# EAGLE design penghis_cahn (EAGLE 7.6.0)
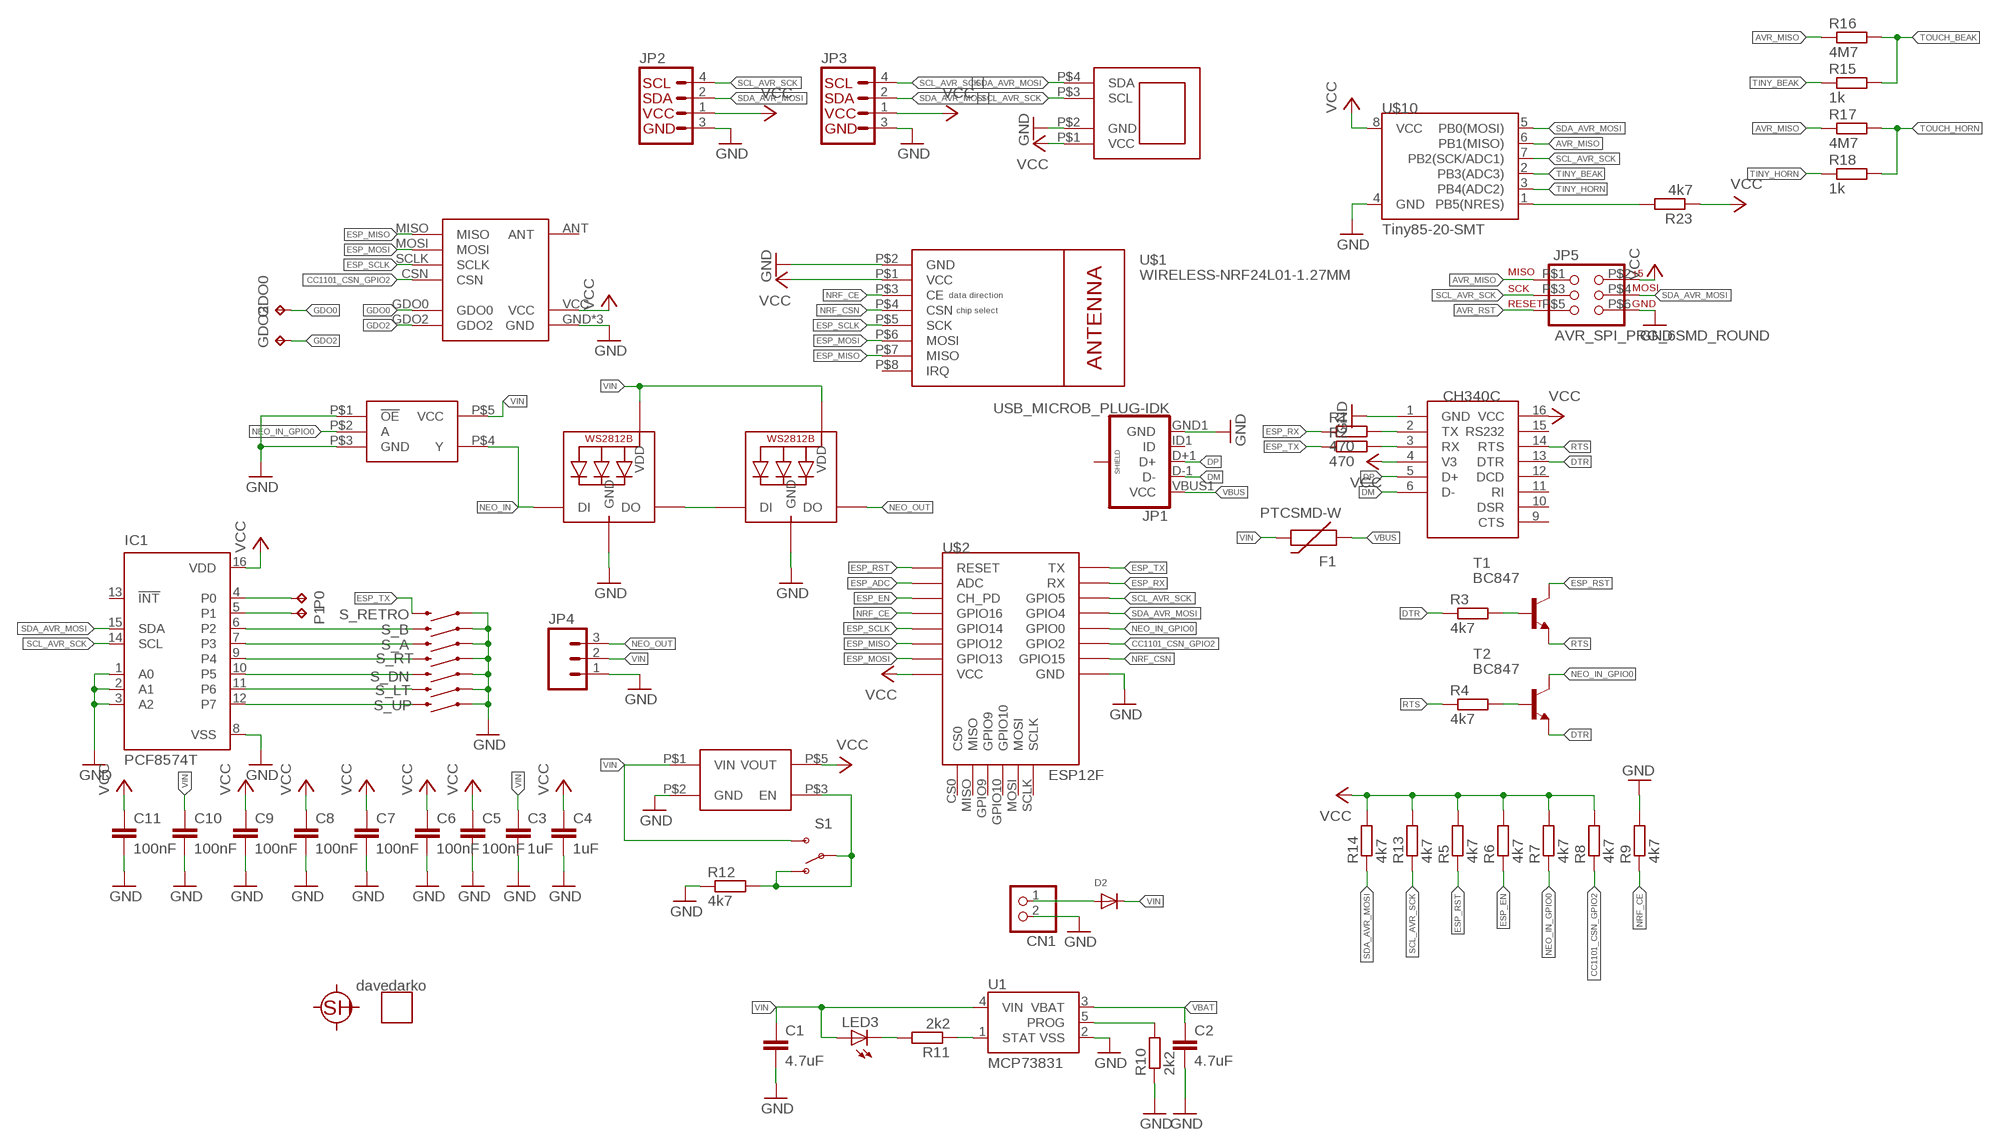
[diagram p0: schematic, sheet 1]

## Parts
C1  4.7uF  C-EUC0805  [C0805]
C2  4.7uF  C-EUC0805  [C0805]
C3  1uF  C-EUC0805  [C0805]
C4  1uF  C-EUC0805  [C0805]
C5  100nF  C-EUC0805  [C0805]
C6  100nF  C-EUC0805  [C0805]
C7  100nF  C-EUC0805  [C0805]
C8  100nF  C-EUC0805  [C0805]
C9  100nF  C-EUC0805  [C0805]
C10  100nF  C-EUC0805  [C0805]
C11  100nF  C-EUC0805  [C0805]
CN1  JST_2PIN-SMT-RA  [JST-PH-2-SMT-RA]
D2  DIODESOD-123  [SOD-123]
F1  PTCSMD-W  [PTC-1206-WIDE]
GDO0  TPB1,27  [B1,27]
GDO2  TPB1,27  [B1,27]
IC1  PCF8574T  [SO16W]
JP1  USB_MICROB_PLUG-IDK  [USB-AB-MICRO-SMD_SLOT]
JP2  I2C_STANDARDI2C_SAO  [2X2]
JP3  I2C_STANDARDI2C_SAO  [2X2]
JP4  M03LOCK  [1X03_LOCK]
JP5  AVR_SPI_PRG_6SMD_ROUND  [2X3_SMD_PAD_ROUND]
LED1  WS2812B5050  [WS2812B]
LED2  WS2812B5050  [WS2812B]
LED3  LEDCHIP-LED0603  [CHIP-LED0603]
P0  TPB1,27  [B1,27]
P1  TPB1,27  [B1,27]
R1  470  R-EU_R0603  [R0603]
R2  470  R-EU_R0603  [R0603]
R3  4k7  R-EU_R0603  [R0603]
R4  4k7  R-EU_R0603  [R0603]
R5  4k7  R-EU_R0603  [R0603]
R6  4k7  R-EU_R0603  [R0603]
R7  4k7  R-EU_R0603  [R0603]
R8  4k7  R-EU_R0603  [R0603]
R9  4k7  R-EU_R0603  [R0603]
R10  2k2  R-EU_R0603  [R0603]
R11  2k2  R-EU_R0603  [R0603]
R12  4k7  R-EU_R0603  [R0603]
R13  4k7  R-EU_R0603  [R0603]
R14  4k7  R-EU_R0603  [R0603]
R15  1k  R-EU_R0603  [R0603]
R16  4M7  R-EU_R0603  [R0603]
R17  4M7  R-EU_R0603  [R0603]
R18  1k  R-EU_R0603  [R0603]
R23  4k7  R-EU_R0603  [R0603]
S1  SWITCH-SPDT-SMD-A  [SWITCH-SPST-SMD-A]
S_A  SWITCH-MOMENTARY-2-SMD-1101NE  [TACTILE-SWITCH-1101NE]
S_B  SWITCH-MOMENTARY-2-SMD-1101NE  [TACTILE-SWITCH-1101NE]
S_DN  SWITCH-MOMENTARY-2-SMD-1101NE  [TACTILE-SWITCH-1101NE]
S_LT  SWITCH-MOMENTARY-2-SMD-1101NE  [TACTILE-SWITCH-1101NE]
S_RETRO  SWITCH-MOMENTARY-2-SMD-1101NE  [TACTILE-SWITCH-1101NE]
S_RT  SWITCH-MOMENTARY-2-SMD-1101NE  [TACTILE-SWITCH-1101NE]
S_UP  SWITCH-MOMENTARY-2-SMD-1101NE  [TACTILE-SWITCH-1101NE]
T1  BC847  [SOT23]
T2  BC847  [SOT23]
U1  MCP73831  [SOT23-5]
U$1  WIRELESS-NRF24L01-1.27MM  [WIRELESS-NRF24L01-1.27MM]
U$2  ESP12F  [ESP12PAD]
U$3  AP2112KAP2112K  [AP2112]
U$4  CH340CCH340C  [SOIC16]
U$5  SN74LV1T125  [SN74LV1T125DBVR]
U$6  CC1101  [CC1101]
U$7  OLED_I2C_VGCD  [OLED_1.3]
U$8  OSHPARK_100MIL_TXT  [OSHPARK_LOGO]
U$9  DAVEDARKODDGOLD  [DAVEDARKO_GOLD]
U$10  Tiny85-20-SMT  ATTINY45TINY85-20-SMT  [SO08-EIAJ]

## Nets
AVR_MISO: JP5.P$1 R16.1 R17.1 U$10.6(PB1(MISO))
AVR_RST: JP5.P$5 R23.2 U$10.1(PB5(NRES))
CC1101_CSN_GPIO2: R8.1 U$2.GPIO2 U$6.CSN
DM: JP1.D-1(D-) U$4.6(D-)
DP: JP1.D+1(D+) U$4.5(D+)
DTR: R3.1 T2.2(E) U$4.13(DTR)
ESP_ADC: U$2.ADC
ESP_EN: R6.1 U$2.EN(CH_PD)
ESP_MISO: U$1.P$7(MISO) U$2.GPIO12 U$6.MISO
ESP_MOSI: U$1.P$6(MOSI) U$2.GPIO13 U$6.MOSI
ESP_RST: R5.1 T1.3(C) U$2.RST(RESET)
ESP_RX: R1.1 U$2.RX
ESP_SCLK: U$1.P$5(SCK) U$2.GPIO14 U$6.SCLK
ESP_TX: R2.1 S_RETRO.P$2 U$2.TX
GDO0: GDO0.TP U$6.GDO0
GDO2: GDO2.TP U$6.GDO2
GND: C1.2 C2.2 C3.2 C4.2 C5.2 C6.2 C7.2 C8.2 C9.2 C10.2 C11.2 CN1.2 IC1.1(A0) IC1.2(A1) IC1.3(A2) IC1.8(VSS) JP1.GND1(GND) JP2.3(GND) JP3.3(GND) JP4.1 JP5.P$6 LED1.3-GND(GND) LED2.3-GND(GND) R9.2 R10.1 R12.1 S_A.P$1 S_B.P$1 S_DN.P$1 S_LT.P$1 S_RETRO.P$1 S_RT.P$1 S_UP.P$1 U1.2(VSS) U$1.P$2(GND) U$2.GND U$3.P$2(GND) U$4.1(GND) U$5.P$1(!OE) U$5.P$3(GND) U$6.GND U$6.GND2(GND) U$6.GND3(GND) U$7.P$2(GND) U$10.4(GND)
N$1: LED1.2-DOUT(DO) LED2.4-DIN(DI)
N$2: IC1.12(P7) S_UP.P$2
N$3: IC1.11(P6) S_LT.P$2
N$4: IC1.10(P5) S_DN.P$2
N$5: IC1.9(P4) S_RT.P$2
N$6: R3.2 T1.1(B)
N$7: R4.2 T2.1(B)
N$8: IC1.7(P3) S_A.P$2
N$9: R12.2 S1.1(O) S1.2(P) U$3.P$3(EN)
N$10: R10.2 U1.5(PROG)
N$11: R11.1 U1.1(STAT)
N$12: R2.2 U$4.3(RX)
N$13: R1.2 U$4.2(TX)
N$14: IC1.6(P2) S_B.P$2
N$15: LED3.C R11.2
NEO_IN: LED1.4-DIN(DI) U$5.P$4(Y)
NEO_IN_GPIO0: R7.1 T2.3(C) U$2.GPIO0 U$5.P$2(A)
NEO_OUT: JP4.3 LED2.2-DOUT(DO)
NRF_CE: R9.1 U$1.P$3(CE) U$2.GPIO16
NRF_CSN: U$1.P$4(CSN) U$2.GPIO15
P0: IC1.4(P0) P0.TP
P1: IC1.5(P1) P1.TP
RTS: R4.1 T1.2(E) U$4.14(RTS)
SCL_AVR_SCK: IC1.14(SCL) JP2.4(SCL) JP3.4(SCL) JP5.P$3 R13.1 U$2.GPIO5 U$7.P$3(SCL) U$10.7(PB2(SCK/ADC1))
SDA_AVR_MOSI: IC1.15(SDA) JP2.2(SDA) JP3.2(SDA) JP5.P$4 R14.1 U$2.GPIO4 U$7.P$4(SDA) U$10.5(PB0(MOSI))
TINY_BEAK: R15.1 U$10.2(PB3(ADC3))
TINY_HORN: R18.1 U$10.3(PB4(ADC2))
TOUCH_BEAK: R15.2 R16.2
TOUCH_HORN: R17.2 R18.2
VBAT: C2.1 CN1.1 D2.A U1.3(VBAT)
VBUS: F1.1 JP1.VBUS1(VCC)
VCC: C4.1 C5.1 C6.1 C7.1 C8.1 C9.1 C11.1 IC1.16(VDD) JP2.1(VCC) JP3.1(VCC) JP5.P$2 R5.2 R6.2 R7.2 R8.2 R13.2 R14.2 R23.1 U$1.P$1(VCC) U$2.VCC U$3.P$5(VOUT) U$4.4(V3) U$4.16(VCC) U$6.VCC U$7.P$1(VCC) U$10.8(VCC)
VIN: C1.1 C3.1 C10.1 D2.C F1.2 JP4.2 LED1.1-VDD(VDD) LED2.1-VDD(VDD) LED3.A S1.3(S) U1.4(VIN) U$3.P$1(VIN) U$5.P$5(VCC)
Unconnected: IC1.13(!INT) JP1.ID1(ID) JP1.P$1(SHIELD) JP1.P$2(SHIELD) JP1.P$3(SHIELD) JP1.P$4(SHIELD) U$1.P$8(IRQ) U$2.CS0 U$2.GPIO9 U$2.GPIO10 U$2.MISO U$2.MOSI U$2.SCLK U$4.9(CTS) U$4.10(DSR) U$4.11(RI) U$4.12(DCD) U$4.15(RS232) U$6.ANT

## Notes on the sheet
- data direction
- chip select

## Library data of the parts
C1-C11 = rcl:C-EU: CAPACITOR, European symbol
CN1 = adafruit:JST_2PIN: JST 2-Pin Connectors of various flavors SMT-RA (S2B-PH-SM4) 4UConnector #17311 SMT (B2B-PH-SM4) THM-RA (S2B-PH) THM (B2B-PH)
D2 = adafruit:DIODE: Diode SMADIODE - SMA Surface Mount Package 20V 1A Schottky Diode Digikey: 641-1014-6-ND DO-1N4148 - Through Hole Small Current Diode SOD-123 20V 1 A (.5mV Vf) Schottky Diode - Digikey: MBRX120TPMSCT-ND SOD-323 10V 570mA (.38mV Vf, 3ns) Schottky Diode - Digikey: ZLLS410CT-ND SOD-523 30V 30mA Schottky Diode (RB751S-40TE61) - Digikey: RB751S-40TE61CT-ND SOT23-R/W - SOT23 Package (R = Solder Paste/Reflow Ovens, W = Hand-Soldering) BAT54Film 40V 300mA - Digikey: 497-7162-1-ND
F1 = SparkFun-PowerIC:PTC: Resettable Fuse PTC Resettable Fuse. Spark Fun Electronics SKU : COM-08357
GDO0 GDO2 P0 P1 = testpad:TP: Test pad
IC1 = micro-philips:PCF8574: I2C-Bus Remote 8-bit I/O expander http://www.semiconductors.philips.com/acrobat_download/datasheets/PCF8574_4.pdf; MPN: PCF8574T/3,512; OC_FARNELL: 1201255; OC_NEWARK: 70R6870
JP1 = SparkFun-Connectors:USB_MICROB_PLUG: USB Micro-B connectors Some male, some female. Watch your step!
JP2 JP3 = SparkFun-Connectors:I2C_STANDARD: SparkFun has standardized on a pinout for all I2C based sensor breakouts. This pinout allows I2C boards to be plugged directly into the headers on Arduino Uno compatible boards, and to be daisy chained easily.
JP4 = SparkFun-Connectors:M03: Header 3 Standard 3-pin 0.1" header. Use with straight break away headers (SKU : PRT-00116), right angle break away headers (PRT-00553), swiss pins (PRT-00743), machine pins (PRT-00117), and female headers (PRT-00115). Molex polarized connector foot print use with SKU : PRT-08232 with associated crimp pins and housings.
JP5 = SparkFun-Connectors:AVR_SPI_PRG_6: AVR ISP 6 Pin This is the reduced ISP connector for AVR programming. Common on Arduino. This footprint will take up less PCB space and can be used with a 10-pin to 6-pin adapter such as SKU: BOB-08508 **Special note about "TEST_POINT" package. The stop mask is on the top side, so if you want your programming test points to be on the bottom of your board, make sure to place this package on the bottom side of the board. This also ensure that the orientation to program from the bottom side will be correct.
LED1 LED2 = adafruit:WS2812B
LED3 = led:LED: LED OSRAM: - CHIPLED LG R971, LG N971, LY N971, LG Q971, LY Q971, LO R971, LY R971 LH N974, LH R974 LS Q976, LO Q976, LY Q976 LO Q996 - Hyper CHIPLED LW Q18S LB Q993, LB Q99A, LB R99A - SideLED LS A670, LO A670, LY A670, LG A670, LP A670 LB A673, LV A673, LT A673, LW A673 LH A674 LY A675 LS A676, LA A676, LO A676, LY A676, LW A676 LS A679, LY A679, LG A679 - Hyper Micro SIDELED® LS Y876, LA Y876, LO Y876, LY Y876 LT Y87S - SmartLED LW L88C, LW L88S LB L89C, LB L89S, LG L890 LS L89K, LO L89K, LY L89K LS L896, LA L896, LO L896, LY L896 - TOPLED LS T670, LO T670, LY T670, LG T670, LP T670 LSG T670, LSP T670, LSY T670, LOP T670, LYG T670 LG T671, LOG T671, LSG T671 LB T673, LV T673, LT T673, LW T673 LH T674 LS T676, LA T676, LO T676, LY T676, LB T676, LH T676, LSB T676, LW T676 LB T67C, LV T67C, LT T67C, LS T67K, LO T67K, LY T67K, LW E67C LS E67B, LA E67B, LO E67B, LY E67B, LB E67C, LV E67C, LT E67C LW T67C LS T679, LY T679, LG T679 LS T770, LO T770, LY T770, LG T770, LP T770 LB T773, LV T773, LT T773, LW T773 LH T774 LS E675, LA E675, LY E675, LS T675 LS T776, LA T776, LO T776, LY T776, LB T776 LHGB T686 LT T68C, LB T68C - Hyper Mini TOPLED® LB M676 - Mini TOPLED Santana® LG M470 LS M47K, LO M47K, LY M47K Source: http://www.osram.convergy.de LUXEON: - LUMILED® LXK2-PW12-R00, LXK2-PW12-S00, LXK2-PW14-U00, LXK2-PW14-V00 LXK2-PM12-R00, LXK2-PM12-S00, LXK2-PM14-U00 LXK2-PE12-Q00, LXK2-PE12-R00, LXK2-PE12-S00, LXK2-PE14-T00, LXK2-PE14-U00 LXK2-PB12-K00, LXK2-PB12-L00, LXK2-PB12-M00, LXK2-PB14-N00, LXK2-PB14-P00, LXK2-PB14-Q00 LXK2-PR12-L00, LXK2-PR12-M00, LXK2-PR14-Q00, LXK2-PR14-R00 LXK2-PD12-Q00, LXK2-PD12-R00, LXK2-PD12-S00 LXK2-PH12-R00, LXK2-PH12-S00 LXK2-PL12-P00, LXK2-PL12-Q00, LXK2-PL12-R00 Source: www.luxeon.com KINGBRIGHT: KA-3528ASYC Source: www.kingbright.com
R1-R18 R23 = rcl:R-EU_: RESISTOR, European symbol
S1 = SparkFun-Electromechanical:SWITCH-SPDT: SPDT Switch Simple slide switch, Spark Fun Electronics SKU : COM-00102 DPDT SMT slide switch, AYZ0202, SWCH-08179
S_A S_B S_DN S_LT S_RETRO S_RT S_UP = SparkFun-Electromechanical:SWITCH-MOMENTARY-2: Various NO switches- pushbuttons, reed, etc
T1 T2 = transistor:BC847: NPN TRANSISTOR
U1 = SparkFun-PowerIC:MCP73831: Miniature single cell, fully integrated Li-Ion, Li-polymer charge management controller http://ww1.microchip.com/downloads/en/DeviceDoc/21984a.pdf IC-09995; PROD_ID: IC-09995
U$1 = diy-modules:WIRELESS-NRF24L01-1.27MM
U$2 = esp8266modules:ESP12F
U$3 = TPS2113:AP2112K
U$4 = ch340g:CH340C
U$5 = SN74LV1T125:SN74LV1T125
U$6 = CC1101:CC1101
U$7 = oled:OLED_I2C_VGCD
U$8 = LOGOS:OSHPARK_100MIL_TXT
U$9 = LOGOS:DAVEDARKO
U$10 = SparkFun-DigitalIC:ATTINY45: Atmel 8-pin 2/4/8kB flash uC; PROD_ID: IC-09092

## Board
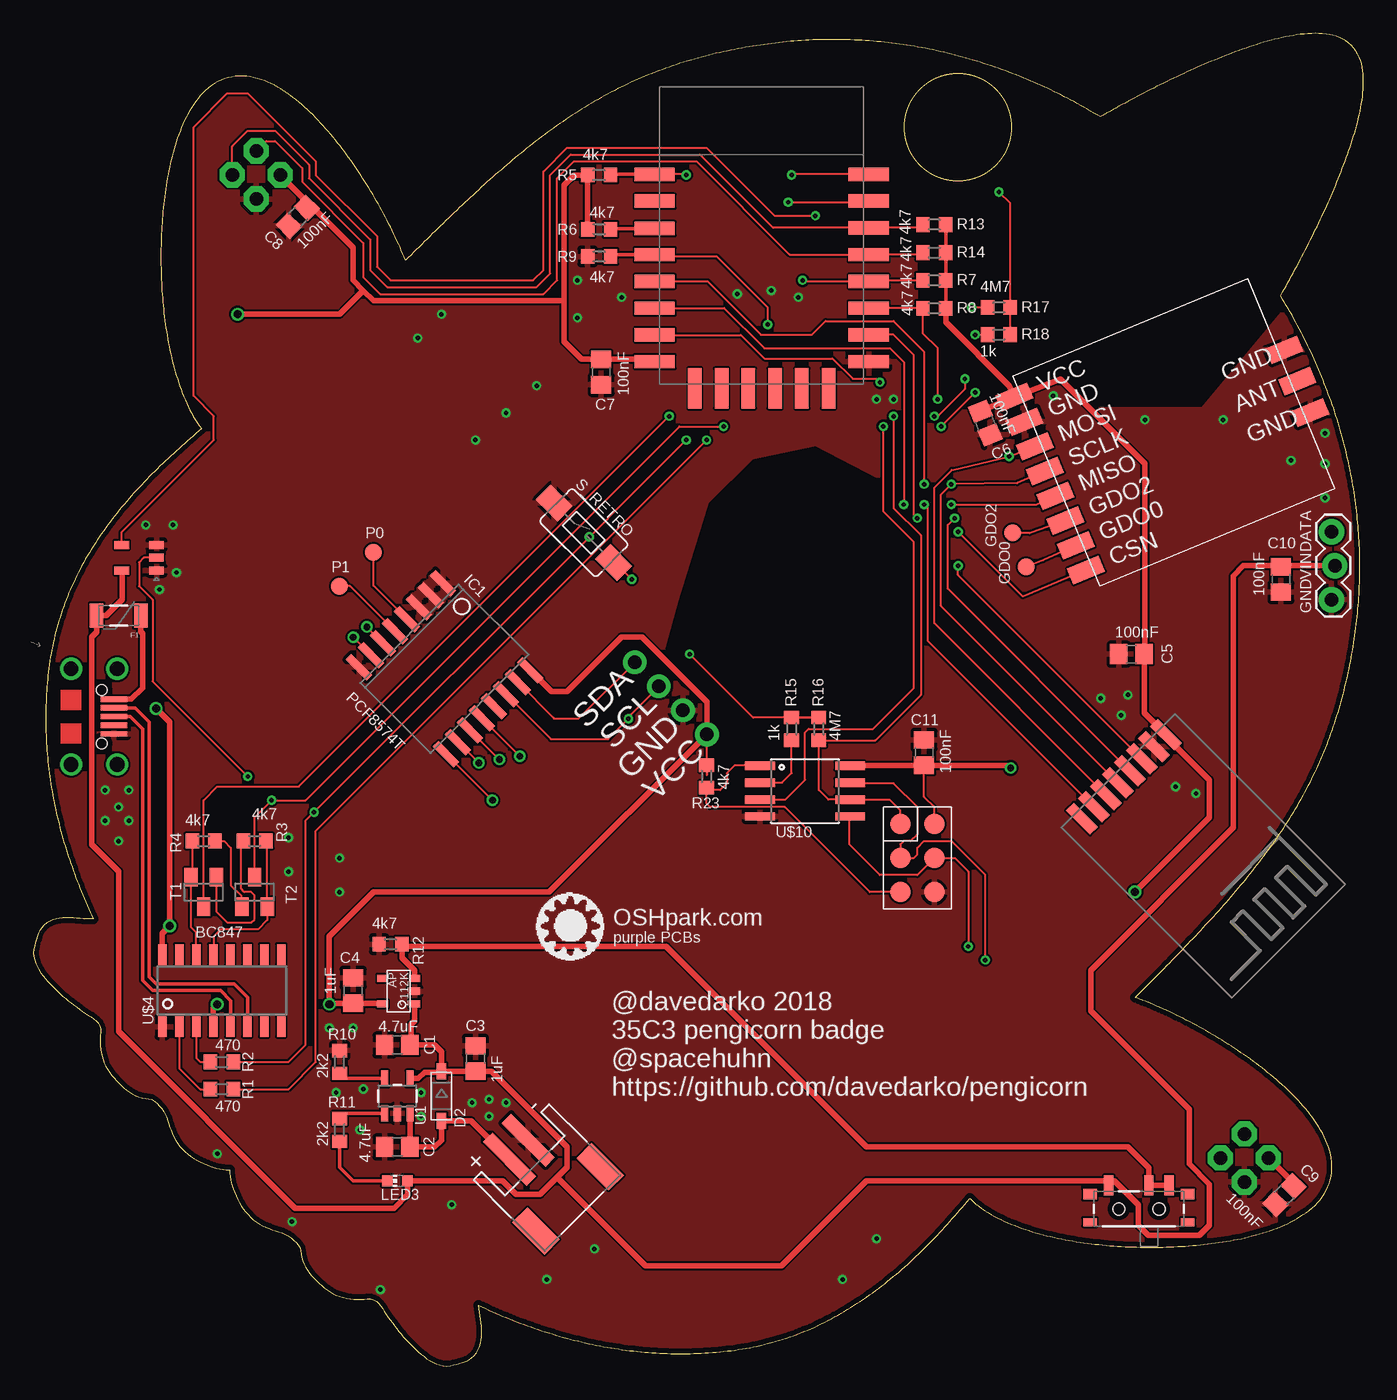
[diagram p1: board, top side]
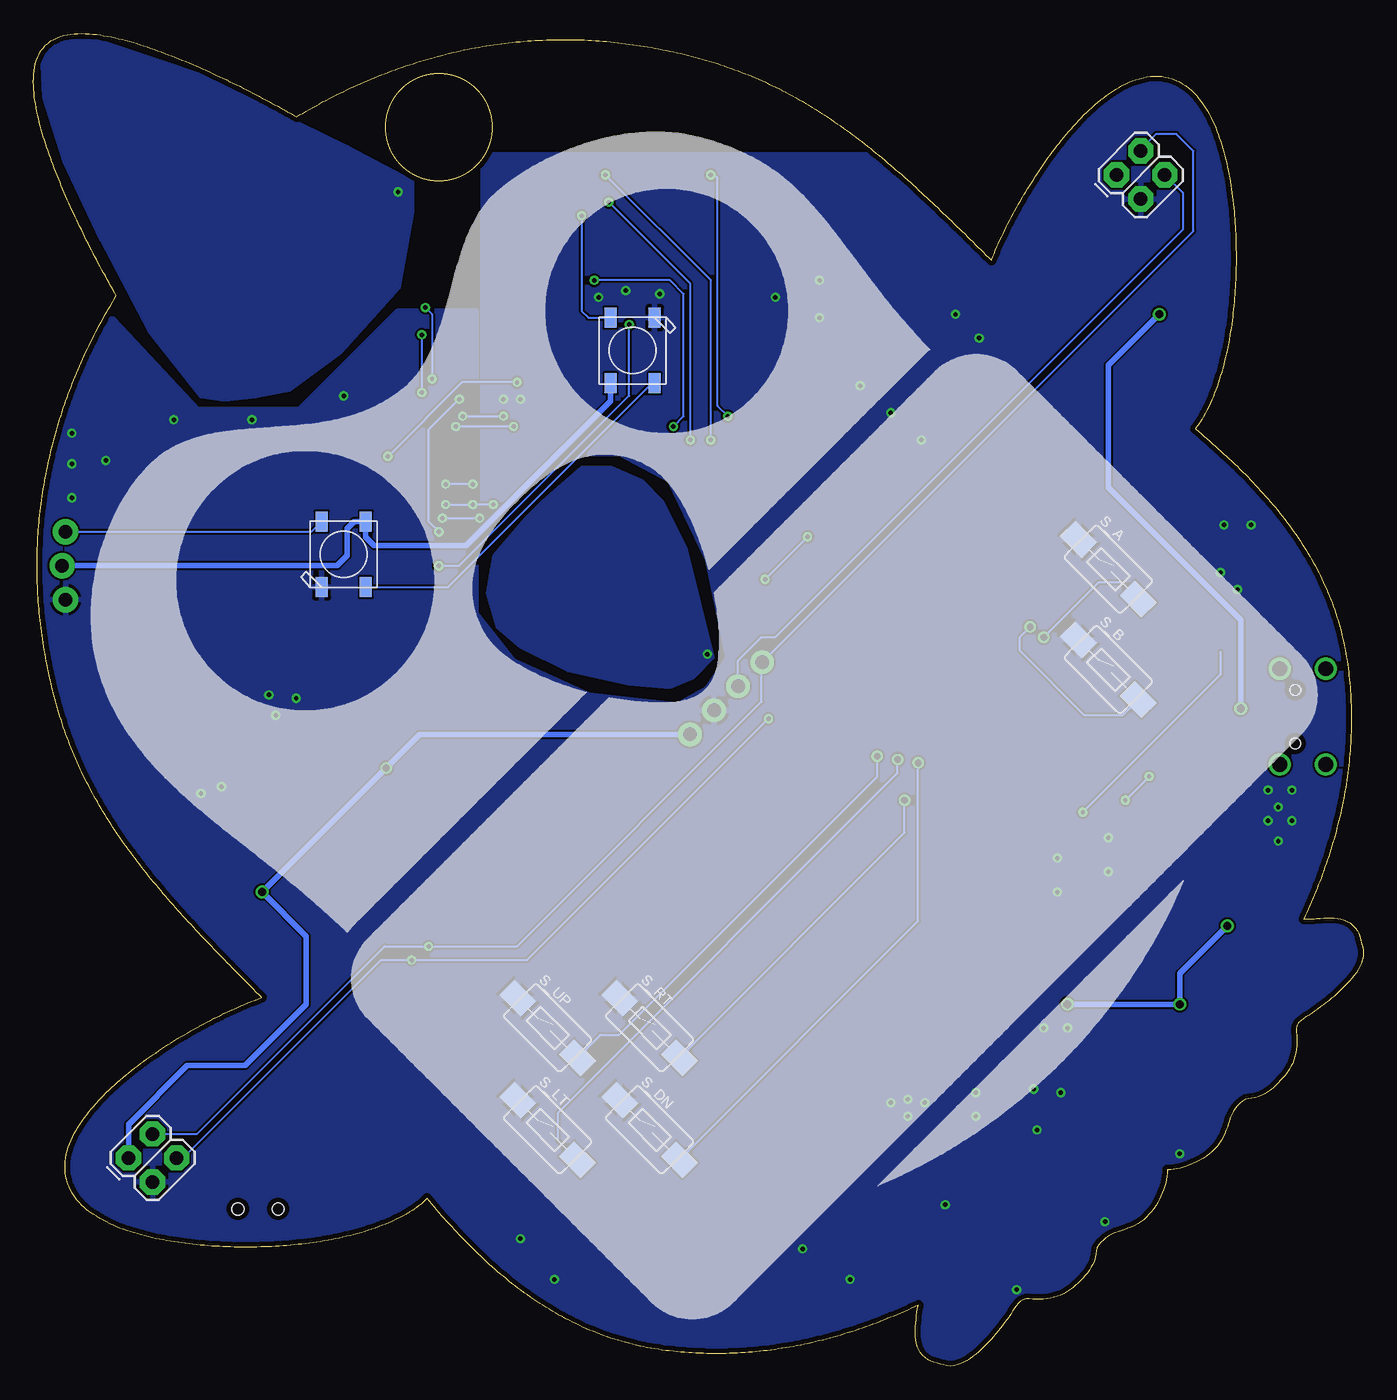
[diagram p2: board, bottom side, seen from below]

Size 99.41 x 99.6 mm. Coordinates in mm from the lower left corner, seen from the top.
Outline: 1439 segments
Outline: circle at 69.11,92.58 radius 4
Copper layers (1*16): Top 0.0356mm / dielectric 1.5011mm / Bottom 0.0356mm
Design rules "LaenPCBOrder *": minimum track width 6mil, minimum drill 13mil, track to track 6mil, track to pad 6mil, pad to pad 6mil, via to via 6mil, smd to smd 6mil, copper to edge 15mil, drill to drill 6mil, minimum pad ring 7mil, minimum via ring 7mil, stop-mask expansion 3mil, vias tented up to drill 200mil, thermal gap 10mil

### Footprints (pad centres in the part's own frame; a part is rotated, then mirrored left to right if it is on the bottom)
C0805 = smd 1.3 x 1.5: 1 -0.95,0; 2 0.95,0
JST-PH-2-SMT-RA = smd 1 x 4.6: 1 1,-3.7; 2 -1,-3.7 | smd 1.6 x 3.4: NC1 -3.4,1.5; NC2 3.4,1.5
SOD-123 = smd 1.2 x 0.7: A 1.85,0; C -1.85,0
PTC-1206-WIDE = smd 1 x 1.8: 1 -1.654,0; 2 1.654,0
B1,27 = smd 1.27 x 1.27: TP 0,0
SO16W = smd 0.6 x 2.2: 1 -4.445,-4.6; 2 -3.175,-4.6; 3 -1.905,-4.6; 4 -0.635,-4.6; 5 0.635,-4.6; 6 1.905,-4.6; 7 3.175,-4.6; 8 4.445,-4.6; 9 4.445,4.6; 10 3.175,4.6; 11 1.905,4.6; 12 0.635,4.6; 13 -0.635,4.6; 14 -1.905,4.6; 15 -3.175,4.6; 16 -4.445,4.6
USB-AB-MICRO-SMD_SLOT = smd 2 x 0.4: D+1 3.2,0; D-1 3.2,0.65; GND1 3.2,-1.3; ID1 3.2,-0.65; VBUS1 3.2,1.3 | drill 1.1: P$1 0,3.575; P$2 0,-3.575; P$3 3.45,-3.575; P$4 3.45,3.575 | hole 0.8: 2.3,2; 2.3,-2
2X2 = drill 1.016 pad 1.88 octagon: 1 0,0; 2 0,2.54; 3 2.54,0; 4 2.54,2.54
1X03_LOCK = drill 1.016 pad 1.88: 1 0,0.127; 2 2.54,-0.127; 3 5.08,0.127
2X3_SMD_PAD_ROUND = smd 1.524 x 1.524: P$1 -1.27,2.54; P$2 1.27,2.54; P$3 -1.27,0; P$4 1.27,0; P$5 -1.27,-2.54; P$6 1.27,-2.54
WS2812B = smd 1.5 x 0.9: 1-VDD 2.45,-1.65; 2-DOUT 2.45,1.65; 3-GND -2.45,1.65; 4-DIN -2.45,-1.65
CHIP-LED0603 = smd 0.8 x 0.8: A 0,-0.75; C 0,0.75
R0603 = smd 1 x 1.1: 1 -0.85,0; 2 0.85,0
SWITCH-SPST-SMD-A = smd 0.7 x 1.5: 1 -2.25,-1.75; 2 -0.75,-1.75; 3 2.25,-1.75 | smd 1 x 0.6: GND1 -3.65,1; GND3 3.65,1 | smd 1 x 0.8: GND2 -3.65,-1.1; GND4 3.65,-1.1 | hole 0.9: -1.5,0; 1.5,0
TACTILE-SWITCH-1101NE = smd 2.3 x 1.6: P$1 -3.15,0; P$2 3.15,0
SOT23 = smd 1 x 1.4: 1 -0.95,-1.1; 2 0.95,-1.1; 3 0,1.1
SOT23-5 = smd 0.55 x 1.2: 1 -0.95,-1.3; 2 0,-1.3; 3 0.95,-1.3; 4 0.95,1.3; 5 -0.95,1.3
WIRELESS-NRF24L01-1.27MM = smd 2.54 x 0.813: P$1 -8.382,4.445; P$2 -8.382,3.175; P$3 -8.382,1.905; P$4 -8.382,0.635; P$5 -8.382,-0.635; P$6 -8.382,-1.905; P$7 -8.382,-3.175; P$8 -8.382,-4.445
ESP12PAD = smd 3 x 1: ADC -8,10.5; EN -8,8.445; GND 8,-1.5; GPIO0 8,4.5; GPIO2 8,2.5; GPIO4 8,6.5; GPIO5 8,8.5; GPIO12 -8,2.5; GPIO13 -8,0.5; GPIO14 -8,4.5; GPIO15 8,0.5; GPIO16 -8,6.5; RST -8,12.5; RX 8,10.5; TX 8,12.5; VCC -8,-1.5 | smd 1 x 3: CS0 -5,-3.5; GPIO9 -1,-3.5; GPIO10 1,-3.5; MISO -3,-3.5; MOSI 3,-3.5; SCLK 5,-3.5
AP2112 = smd 0.55 x 0.8: P$1 0.95,1.2; P$2 0,1.2; P$3 -0.95,1.2; P$4 -0.95,-1.2; P$5 0.95,-1.2
SOIC16 = smd 0.635 x 1.524: 1 -4.445,-2.695; 2 -3.175,-2.695; 3 -1.905,-2.695; 4 -0.635,-2.695; 5 0.635,-2.695; 6 1.905,-2.695; 7 3.175,-2.695; 8 4.445,-2.695; 9 4.445,2.695; 10 3.175,2.695; 11 1.905,2.695; 12 0.635,2.695; 13 -0.635,2.695; 14 -1.905,2.695; 15 -3.175,2.695; 16 -4.445,2.695
SN74LV1T125DBVR = smd 1.1 x 0.6: P$1 -1.3,0.95; P$2 -1.3,0; P$3 -1.3,-0.95; P$4 1.3,-0.95; P$5 1.3,0.95
CC1101 = smd 1.27 x 2.54: ANT 0,10; CSN 7,-10; GDO0 5,-10; GDO2 3,-10; GND -5,-10; GND2 -2.54,10; GND3 2.54,10; MISO 1,-10; MOSI -3,-10; SCLK -1,-10; VCC -7,-10
OLED_1.3 = drill 1 pad 1.778: P$1 -3.81,0; P$2 -1.27,0; P$3 1.27,0; P$4 3.81,0
SO08-EIAJ = smd 0.61 x 2.21: 1 -1.905,-3.378; 2 -0.635,-3.378; 3 0.635,-3.378; 4 1.905,-3.378; 5 1.905,3.353; 6 0.635,3.353; 7 -0.635,3.353; 8 -1.905,3.353

### Placement (x,y rotation side)
C1  27.2,24 180 top
C2  27.2,16.38 180 top
C3  33.04,22.98 90 top
C4  23.9,28.06 90 top
C5  82.06,53.21 180 top
C6  71.14,70.48 292.5 top
C7  42.44,74.29 270 top
C8  19.76,85.9 225 top
C9  93.49,12.78 225 top
C10  93.24,58.8 270 top
C11  66.57,45.84 90 top
CN1  38.89,13.56 225 top
D2  30.5,20.19 270 top
F1  6.37,56.1 180 top
GDO0  74.19,59.72 0 top
GDO2  73.17,62.26 0 top
IC1  30.72,52.12 225 top
JP1  2.81,48.54 0 top
JP2  92.31,15.55 315 bottom
JP3  18.45,89.02 315 bottom
JP4  97.14,57.27 90 top
JP5  66.06,37.97 0 top
LED1  54.63,75.91 270 bottom
LED2  76.22,60.67 90 bottom
LED3  27.2,13.84 90 top
P0  25.42,60.83 0 top
P1  22.88,58.29 0 top
R1  14.08,20.7 180 top
R2  14.08,22.73 180 top
R3  16.53,39.24 180 top
R4  12.72,39.24 0 top
R5  42.28,89.02 180 top
R6  42.28,84.96 180 top
R7  67.33,81.15 0 top
R8  67.33,79.05 0 top
R9  42.28,82.93 180 top
R10  22.88,22.73 270 top
R11  22.88,17.65 270 top
R12  26.69,31.52 0 top
R13  67.33,85.31 0 top
R14  67.33,83.21 0 top
R15  56.66,47.62 90 top
R16  58.69,47.62 90 top
R17  72.16,79.12 0 top
R18  72.16,77.08 0 top
R23  50.31,44.06 270 top
S1  82.62,11.74 180 top
S_A  19.07,59.56 315 bottom
S_B  19.07,52.04 315 bottom
S_DN  53.36,17.65 315 bottom
S_LT  60.98,17.65 315 bottom
S_RETRO  41.14,62.28 315 top
S_RT  53.36,25.27 315 bottom
S_UP  60.98,25.27 315 bottom
T1  12.72,35.43 180 top
T2  16.53,35.43 0 top
U1  27.2,20.19 0 top
U$1  87.43,38.12 315 top
U$2  54.43,76.57 0 top
U$3  27.29,28.02 270 top
U$4  14.08,28.06 0 top
U$5  7.89,60.41 180 top
U$6  85.23,69.79 292.5 top
U$7  47.64,49.91 45 bottom
U$8  49.04,32.89 0 top
U$9  39.9,25.01 0 top
U$10  57.68,42.97 270 top

### Tracks (layer width: path | path; a pad name or v marks a point on that pad's centre or on a via)
AVR_MISO  (via drill 0.33)
  Top 0.152: JP5.P$1 64.79,41.52 63.98,42.33 U$10.6 59.41,42.33 58.69,43.05 R16.1 62.92,46.77 66.31,50.16 66.31,62.1 64.28,64.13 v64.28,70.99 | R17.1 v70.12,79.12 | v69.62,73.78 69.62,73.02 67.58,70.99 v67.33,70.99
  Bottom 0.152: v70.12,79.12 69.62,78.61 v69.62,73.78 | v67.33,70.99 v64.28,70.99
AVR_RST
  Top 0.152: U$10.1 52.39,44.87 51.84,44.32 51.84,43.56 51.33,43.05 50.22,43.05 R23.2 50.31,42.03 50.57,41.78 56.15,41.78 62.5,35.43 JP5.P$5
CC1101_CSN_GPIO2  (via drill 0.33)
  Top 0.152: U$6.CSN 73.93,57.53 v69.11,62.35 | 62.48,79.12 66.42,79.12 R8.1 66.48,77.17 67.58,76.07 v67.58,72.26
  Top 0.254: 62.48,79.12 U$2.GPIO2
  Bottom 0.152: v69.11,62.35 69.87,63.11 69.87,69.97 v67.58,72.26
DM
  Top 0.254: JP1.D-1 7.59,49.19 8.66,48.13 8.66,29.08 9.16,28.57 15.01,28.57 16.02,27.55 16.02,26.16 U$4.6
DP
  Top 0.254: JP1.D+1 7.23,48.54 8.15,47.62 8.15,28.82 8.91,28.06 13.99,28.06 14.75,27.3 14.75,26.16 U$4.5
DTR
  Top 0.152: U$4.13 13.48,30.79 13.48,32.13 13.99,32.63 16.78,32.63 17.48,33.33 T2.2 17.48,39.14 R3.1
ESP_EN
  Top 0.254: U$2.EN 43.18,85.01 R6.1
ESP_MISO  (via drill 0.33)
  Top 0.152: v66.57,64.38 66.82,64.38 66.82,54.23 U$1.P$7 | U$2.GPIO12 51.63,79.07 54.63,76.07 64.03,76.07 65.04,75.05 v65.04,64.38 | v68.6,64.38 74.95,64.38 U$6.MISO
  Bottom 0.152: v68.6,64.38 v66.57,64.38 v65.04,64.38
ESP_MOSI  (via drill 0.33)
  Top 0.152: U$1.P$6 67.33,55.52 67.33,65.65 68.65,66.97 v72.92,67.99 U$6.MOSI | U$2.GPIO13 52.87,77.07 54.63,75.31 59.71,75.31 61.23,73.78 63.01,73.78 v63.27,73.53
  Bottom 0.152: v63.27,73.53 67.38,73.53 v72.92,67.99
ESP_RST  (via drill 0.33)
  Top 0.152: T1.3 12.72,42.29 13.74,43.3 19.83,43.3 v47.52,70.99 | v48.79,89.02 48.74,89.07 45.74,89.07
  Top 0.254: U$2.RST 45.74,89.07 43.17,89.07 R5.1
  Bottom 0.152: v47.52,70.99 48.28,71.75 48.28,88.77 48.53,89.02 v48.79,89.02
ESP_RX  (via drill 0.33)
  Top 0.152: R1.1 19.07,20.7 21.1,22.73 21.1,40 v50.31,69.21 | v56.41,86.99 62.35,86.99 U$2.RX
  Bottom 0.152: v50.31,69.21 50.31,80.89 v56.41,86.99
ESP_SCLK  (via drill 0.33)
  Top 0.152: U$1.P$5 67.84,56.81 67.84,65.15 v68.6,65.91 73.5,65.99 U$6.SCLK | U$2.GPIO14 50.39,81.07 54.38,77.08 58.19,77.08 59.2,78.1 64.28,78.1 66.57,75.81 v66.57,65.91
  Bottom 0.152: v66.57,65.91 v68.6,65.91
ESP_TX  (via drill 0.33)
  Top 0.152: R2.1 19.07,22.73 20.34,24 20.34,40.76 v20.97,41.4 v41.55,61.97 44.34,64.77 v48.79,69.21 | U$2.TX 56.71,89.07 v56.66,89.02 | S_RETRO.P$2 43.47,60.05 v44.72,58.8
  Bottom 0.152: v48.79,69.21 48.79,81.15 v56.66,89.02 | 10.69,53.38 10.69,51.68 v20.97,41.4 | v44.72,58.8 v41.55,61.97
GDO0
  Top 0.152: U$6.GDO0 75.47,60.24 GDO0.TP
GDO2
  Top 0.152: U$6.GDO2 74.46,62.24 GDO2.TP
GND  (via drill 0.33)
  other vias: 40.66,81.15 43.96,79.88 40.66,78.35 55.14,80.39 57.17,79.88 52.6,80.13 96.54,67.43 96.54,64.89 96.54,69.72 88.92,70.73 94,67.69 76.22,72.51 63.01,72.26 64.28,72.26 30.5,78.61 28.72,76.83 33.04,69.21 35.33,71.24 37.61,73.27 8.4,62.86 10.43,62.86 9.42,58.03 10.69,59.3 5.35,43.05 7.13,43.05 5.35,40.76 7.13,40.76 6.37,41.78 6.37,39.24 23.9,25.27 22.12,25.27 24.4,17.65 28.98,20.44 28.98,18.66 24.66,20.7 22.63,20.44 34.06,19.93 35.33,19.68 32.79,19.68 34.06,18.66 81.81,50.16 81.3,48.64 85.36,43.3 86.89,42.79 79.78,49.91 83.08,70.73 22.88,35.43 22.88,37.97 19.07,39.49 19.07,36.95 31.26,12.06 41.93,8.76 38.37,6.47 63.01,9.52 60.47,6.47 13.74,15.87 19.32,10.79 25.93,5.71
  pour Top (isolate 0.152): -5.98,103.03 35.58,103.03 35.58,90.55 65.81,90.55 66.06,64.13 64.28,65.91 58.44,68.96 53.61,67.94 50.31,64.64 48.03,57.27 46.76,52.7 48.28,50.67 51.58,48.64 57.68,49.65 64.03,52.19 66.82,56.26 66.31,61.59 66.31,79.12 72.16,79.12 76.73,74.29 79.52,71.5 87.4,71.5 93.75,79.12 104.16,79.12 104.27,74.33 104.02,-4.97 -5.98,-4.97
  pour Bottom (isolate 0.152): -7.6,109.25 35.58,109.25 35.58,90.55 65.81,90.55 65.81,61.84 58.95,68.19 55.65,68.19 51.84,66.16 49.04,60.32 47.52,52.95 49.04,50.67 51.33,49.4 57.93,50.16 63.52,52.7 66.31,56.26 66.31,78.86 72.16,78.86 79.52,71.5 87.14,71.5 94,78.86 106.7,78.77 106.7,-2.51 -7.6,-2.51
N$1
  Bottom 0.152: LED2.4-DIN 68.42,58.22 53.23,73.4 LED1.2-DOUT
N$2  (via drill 0.5)
  Top 0.152: v36.34,45.59 33.53,48.4 IC1.12
  Bottom 0.152: S_UP.P$2 57.03,24.76 55.65,24.76 36.34,44.06 v36.34,45.59
N$3  (via drill 0.5)
  Top 0.152: v34.82,45.33 IC1.11
  Bottom 0.152: S_LT.P$2 60.22,16.89 60.22,18.92 34.82,44.32 v34.82,45.33
N$4  (via drill 0.5)
  Top 0.152: v33.29,45.08 31.75,46.62 IC1.10
  Bottom 0.152: S_DN.P$2 33.29,33.26 v33.29,45.08
N$5  (via drill 0.5)
  Top 0.152: v34.31,42.29 30.87,45.72 IC1.9
  Bottom 0.152: S_RT.P$2 34.31,39.86 v34.31,42.29
N$6
  Top 0.152: T1.1 13.67,33.97 14.5,33.14 16.28,33.14 16.53,33.4 16.53,35.17 16.28,35.43 15.77,35.43 15.51,35.68 15.51,39.4 R3.2
N$7
  Top 0.152: R4.2 14.24,39.24 14.75,38.73 14.75,35.94 15.51,35.17 15.51,34.39 T2.1
N$8  (via drill 0.5)
  Top 0.152: v23.9,54.48 25.22,53.15 IC1.7
  Bottom 0.152: S_A.P$2 18.05,58.54 19.83,58.54 v23.9,54.48
N$9
  Top 0.406: S1.1 S1.2 83.37,14.82 81.81,16.38 62.25,16.38 47.26,31.36 27.89,31.36 R12.2 27.54,30.51 28.49,29.56 U$3.P$3
N$10
  Top 0.254: U1.5 23.27,21.49 R10.2
N$11
  Top 0.254: U1.1 23.27,18.89 R11.1
N$12
  Top 0.152: U$4.3 12.18,23.02 12.47,22.73 R2.2
N$13
  Top 0.152: U$4.2 10.91,22.25 12.47,20.7 R1.2
N$14  (via drill 0.5)
  Top 0.152: v24.91,55.24 IC1.6
  Bottom 0.152: S_B.P$2 18.02,48.64 20.85,48.64 25.67,53.46 25.67,54.48 v24.91,55.24
N$15
  Top 0.254: R11.2 22.88,14.85 23.9,13.84 LED3.C
NEO_IN  (via drill 0.33)
  Top 0.152: U$5.P$4 6.59,62.32 13.48,69.21 13.48,70.99 11.96,72.51 11.96,92.58 14.5,95.12 16.02,95.12 21.1,90.04 21.1,89.02 25.67,84.45 25.67,82.16 26.69,81.15 37.36,81.15 38.12,81.91 38.12,89.28 39.9,91.05 50.31,91.05 55.39,85.97 v58.44,85.97
  Bottom 0.152: v58.44,85.97 58.44,78.86 57.93,78.35 LED1.4-DIN
NEO_IN_GPIO0  (via drill 0.33)
  Top 0.152: T2.3 16.53,41.02 v17.8,42.29 20.34,42.29 48.28,70.23 v51.58,70.23 | v57.49,81.15 57.63,81.07 U$2.GPIO0 | U$5.P$2 8.24,60.41 7.89,60.07 7.89,58.29 8.91,57.27 8.91,51.18 v16.02,44.06 | 62.51,81.15 R7.1
  Top 0.254: 62.51,81.15 U$2.GPIO0
  Bottom 0.152: v51.58,70.23 50.82,70.99 50.82,80.13 51.84,81.15 v57.49,81.15 | v16.02,44.06 v17.8,42.29
NEO_OUT
  Bottom 0.152: JP4.3 78.64,62.35 LED2.2-DOUT
NRF_CE  (via drill 0.33)
  Top 0.152: U$1.P$3 69.11,59.13 v69.11,59.81 | v54.88,77.85 54.88,79.12 51.07,82.93 46.57,82.93 U$2.GPIO16
  Top 0.254: U$2.GPIO16 43.27,83.07 R9.1
  Bottom 0.152: v69.11,59.81 67.58,59.81 54.88,72.51 v54.88,77.85
NRF_CSN  (via drill 0.33)
  Top 0.152: U$1.P$4 68.35,58.1 68.35,62.86 v68.85,63.37 | v66.06,63.37 65.81,63.62 65.81,75.56 64.28,77.08 62.45,77.08 U$2.GPIO15
  Bottom 0.152: v68.85,63.37 v66.06,63.37
P0
  Top 0.152: IC1.4 25.42,58.32 P0.TP
P1
  Top 0.152: IC1.5 23.65,58.29 P1.TP
RTS
  Top 0.152: R4.1 11.87,36.63 T1.2 11.77,32.82 12.18,32.41 U$4.14
SCL_AVR_SCK  (via drill 0.33)
  Top 0.152: JP3.4 14.86,91.16 16.02,92.32 18.05,92.32 20.59,89.78 20.59,88.77 25.17,84.2 25.17,81.91 26.44,80.64 37.61,80.64 38.63,81.66 38.63,89.02 40.15,90.55 49.8,90.55 55.28,85.07 U$2.GPIO5 | U$7.P$3 44.57,48.64 v44.47,48.38 42.95,46.86 38.68,46.86 IC1.14 | 62.63,85.12 66.29,85.12 R13.1 | U$10.7 61.08,43.56 64.28,43.56 66.06,41.78 66.06,39.75 65.55,39.24 65.04,39.24 64.79,38.98 JP5.P$3 65.81,37.97 66.06,38.22 66.06,38.73 66.57,39.24 68.6,39.24 71.14,36.7 v71.14,30.35
  Top 0.254: 62.63,85.12 U$2.GPIO5
  Bottom 0.152: U$7.P$3 46.74,52.71 44.98,54.48 43.96,54.48 13.48,84.96 13.48,87.65 JP3.4 | JP2.4 88.22,15.55 73.43,30.35 v71.14,30.35 62.5,30.35 v44.47,48.38
SDA_AVR_MOSI  (via drill 0.33)
  Top 0.152: JP3.2 17.4,91.56 18.05,91.56 20.09,89.53 20.09,88.51 24.66,83.94 24.66,81.4 25.93,80.13 38.12,80.13 39.14,81.15 39.14,88.77 40.41,90.04 49.55,90.04 56.52,83.07 U$2.GPIO4 | 62.45,83.09 66.35,83.09 R14.1 | IC1.15 38.88,48.45 38.88,48.38 40.73,48.38 U$7.P$4 | v69.87,31.36 69.87,36.95 68.85,37.97 JP5.P$4 66.06,36.7 63.27,36.7 60.98,38.98 60.98,41.01 U$10.5
  Top 0.254: 62.45,83.09 U$2.GPIO4
  Bottom 0.152: JP3.2 16.65,90.93 15.51,92.07 13.99,92.07 12.72,90.8 12.72,84.83 U$7.P$4 44.98,52.57 44.98,49.65 63.27,31.36 v69.87,31.36 73.17,31.36 87.19,17.35 JP2.2
TINY_BEAK
  Top 0.152: U$10.2 55.95,43.6 56.66,44.32 R15.1
TINY_HORN  (via drill 0.33)
  Top 0.152: U$10.3 56.2,42.33 57.68,43.81 57.68,47.37 57.93,47.62 62.76,47.62 65.81,50.67 65.81,61.59 63.52,63.88 v63.52,70.23 | v67.84,70.23 v70.38,72.77 | v70.38,77.08 R18.1
  Bottom 0.152: v63.52,70.23 v67.84,70.23 | v70.38,72.77 v70.38,77.08
TOUCH_BEAK  (via drill 0.33)
  Top 0.152: R15.2 R16.2 53.78,48.47 v49.04,53.21
  pour Bottom (isolate 0.254): 58.44,67.18 62.25,63.88 65.04,60.57 65.55,57.78 64.79,55.24 63.01,53.72 59.46,51.94 54.88,50.92 51.84,50.67 50.06,51.43 48.53,52.95 50.57,61.08 52.34,64.64 53.87,66.16 56.15,67.18
TOUCH_HORN  (via drill 0.33)
  Top 0.152: R18.2 R17.2 73.01,86.9 v72.16,87.75
  pour Bottom: 71.14,86.23 72.16,80.64 76.47,75.81 80.28,73.02 82.82,72.51 85.11,72.26 86.89,72.51 90.7,77.34 94.25,84.2 97.05,90.04 98.57,94.86 98.83,100.45 86.89,96.39 75.97,91.05 71.14,88.51
VBAT
  Top 0.406: U1.3 C2.1 29.99,16.38 30.5,16.89 D2.A 32.7,18.34 CN1.1
VBUS
  Top 0.406: JP1.VBUS1 7.32,49.84 8.15,50.67 8.15,54.76 8.02,54.89 F1.1
VCC  (via drill 0.5, 0.6)
  Top 0.152: R23.1 50.33,44.18 U$7.P$1 | JP5.P$2 67.33,41.78 66.57,42.54 C11.1
  Top 0.254: R13.2 R14.2 R7.2 R8.2
  Top 0.406: U$6.VCC 76.75,73.76 83.08,67.43 83.08,53.27 C5.1 83.01,48.82 U$1.P$1 84.64,47.07 87.9,43.81 87.9,41.02 v82.32,35.43 | U$6.VCC 72.94,73.26 68.18,78.01 R8.2 | 39.64,79.62 39.64,76.58 40.98,75.24 C7.1 46.26,75.24 U$2.VCC | 39.64,79.62 39.64,88.26 40.41,89.02 R5.2 R6.2 | 24.66,80.39 23.9,81.15 23.9,83.58 20.9,86.57 C8.1 20.43,87.04 JP3.1 | 24.66,80.39 25.42,79.62 39.64,79.62 | U$4.16 9.64,32.35 v10.18,32.89 10.18,48.13 v9.16,49.14 | v13.74,27.05 13.45,26.76 U$4.4 | U$3.P$5 26.05,27.11 C4.1 22.18,27.11 v22.12,27.05 22.12,32.13 25.42,35.43 38.55,35.43 U$7.P$1 50.33,49.63 45.49,54.48 43.96,54.48 39.9,50.41 38.71,50.41 IC1.16 | JP2.1 94.16,13.69 C9.1 | v15.26,78.61 22.88,78.61 24.66,80.39 | 72.87,44.87 v73.04,44.7 72.85,44.89 C11.1 66.55,44.87 U$10.8 | U$6.VCC C6.1
  Bottom 0.406: JP2.1 92.31,18.07 87.9,22.47 83.59,22.47 79.01,27.05 79.01,32.13 v82.32,35.43 v73.04,44.7 70.53,47.21 U$7.P$1 | v10.18,32.89 13.74,29.33 v13.74,27.05 v22.12,27.05 | v9.16,49.14 9.16,55.75 19.07,65.65 19.07,74.8 v15.26,78.61
VIN
  Top 0.254: 34.24,22.04 34.23,22.03
  Top 0.406: 28.18,21.46 U1.4 28.75,21.49 29.23,21.97 30.43,21.97 D2.C | D2.C 30.5,23.49 29.99,24 C1.1 28.21,24.06 28.21,25.52 28.49,25.8 U$3.P$1 | 39.14,14.09 37.87,12.82 36.09,12.82 35.07,13.84 LED3.A 27.96,13.83 27.96,12.82 26.94,11.81 19.58,11.81 6.37,25.01 6.37,36.95 4.34,38.98 4.34,54.48 4.72,54.86 F1.2 5.45,56.1 6.62,57.27 6.62,59.43 U$5.P$5 | 39.14,14.09 39.9,14.85 39.9,16.38 34.24,22.04 | S1.3 80.28,13.84 | 80.28,13.84 62.25,13.84 55.9,7.49 45.74,7.49 39.14,14.09 | D2.C C3.1 34.23,22.03 | JP4.2 93.3,59.81 | 93.3,59.81 C10.1 | 80.28,13.84 80.79,13.84 82.57,12.06 82.57,10.54 83.33,9.77 87.14,9.77 87.9,10.54 87.9,13.58 86.38,15.11 86.38,19.17 79.01,26.54 79.01,29.59 89.68,40.25 89.68,59.05 90.44,59.81 93.3,59.81
  Bottom 0.406: LED1.1-VDD 56.28,72.13 67.08,61.34 73.93,61.34 74.57,61.97 LED2.1-VDD 75.45,63.12 75.97,62.61 75.97,60.57 76.73,59.81 JP4.2

### Text on the board
tNames: DATA | VIN | GND | SDA | SCL | GND | VCC | @davedarko 2018 / 35C3 pengicorn badge / @spacehuhn / https://github.com/davedarko/pengicorn